# EAGLE schematic JN_Magic Mitts Schematic Proto A v6 (EAGLE 9.7.0)
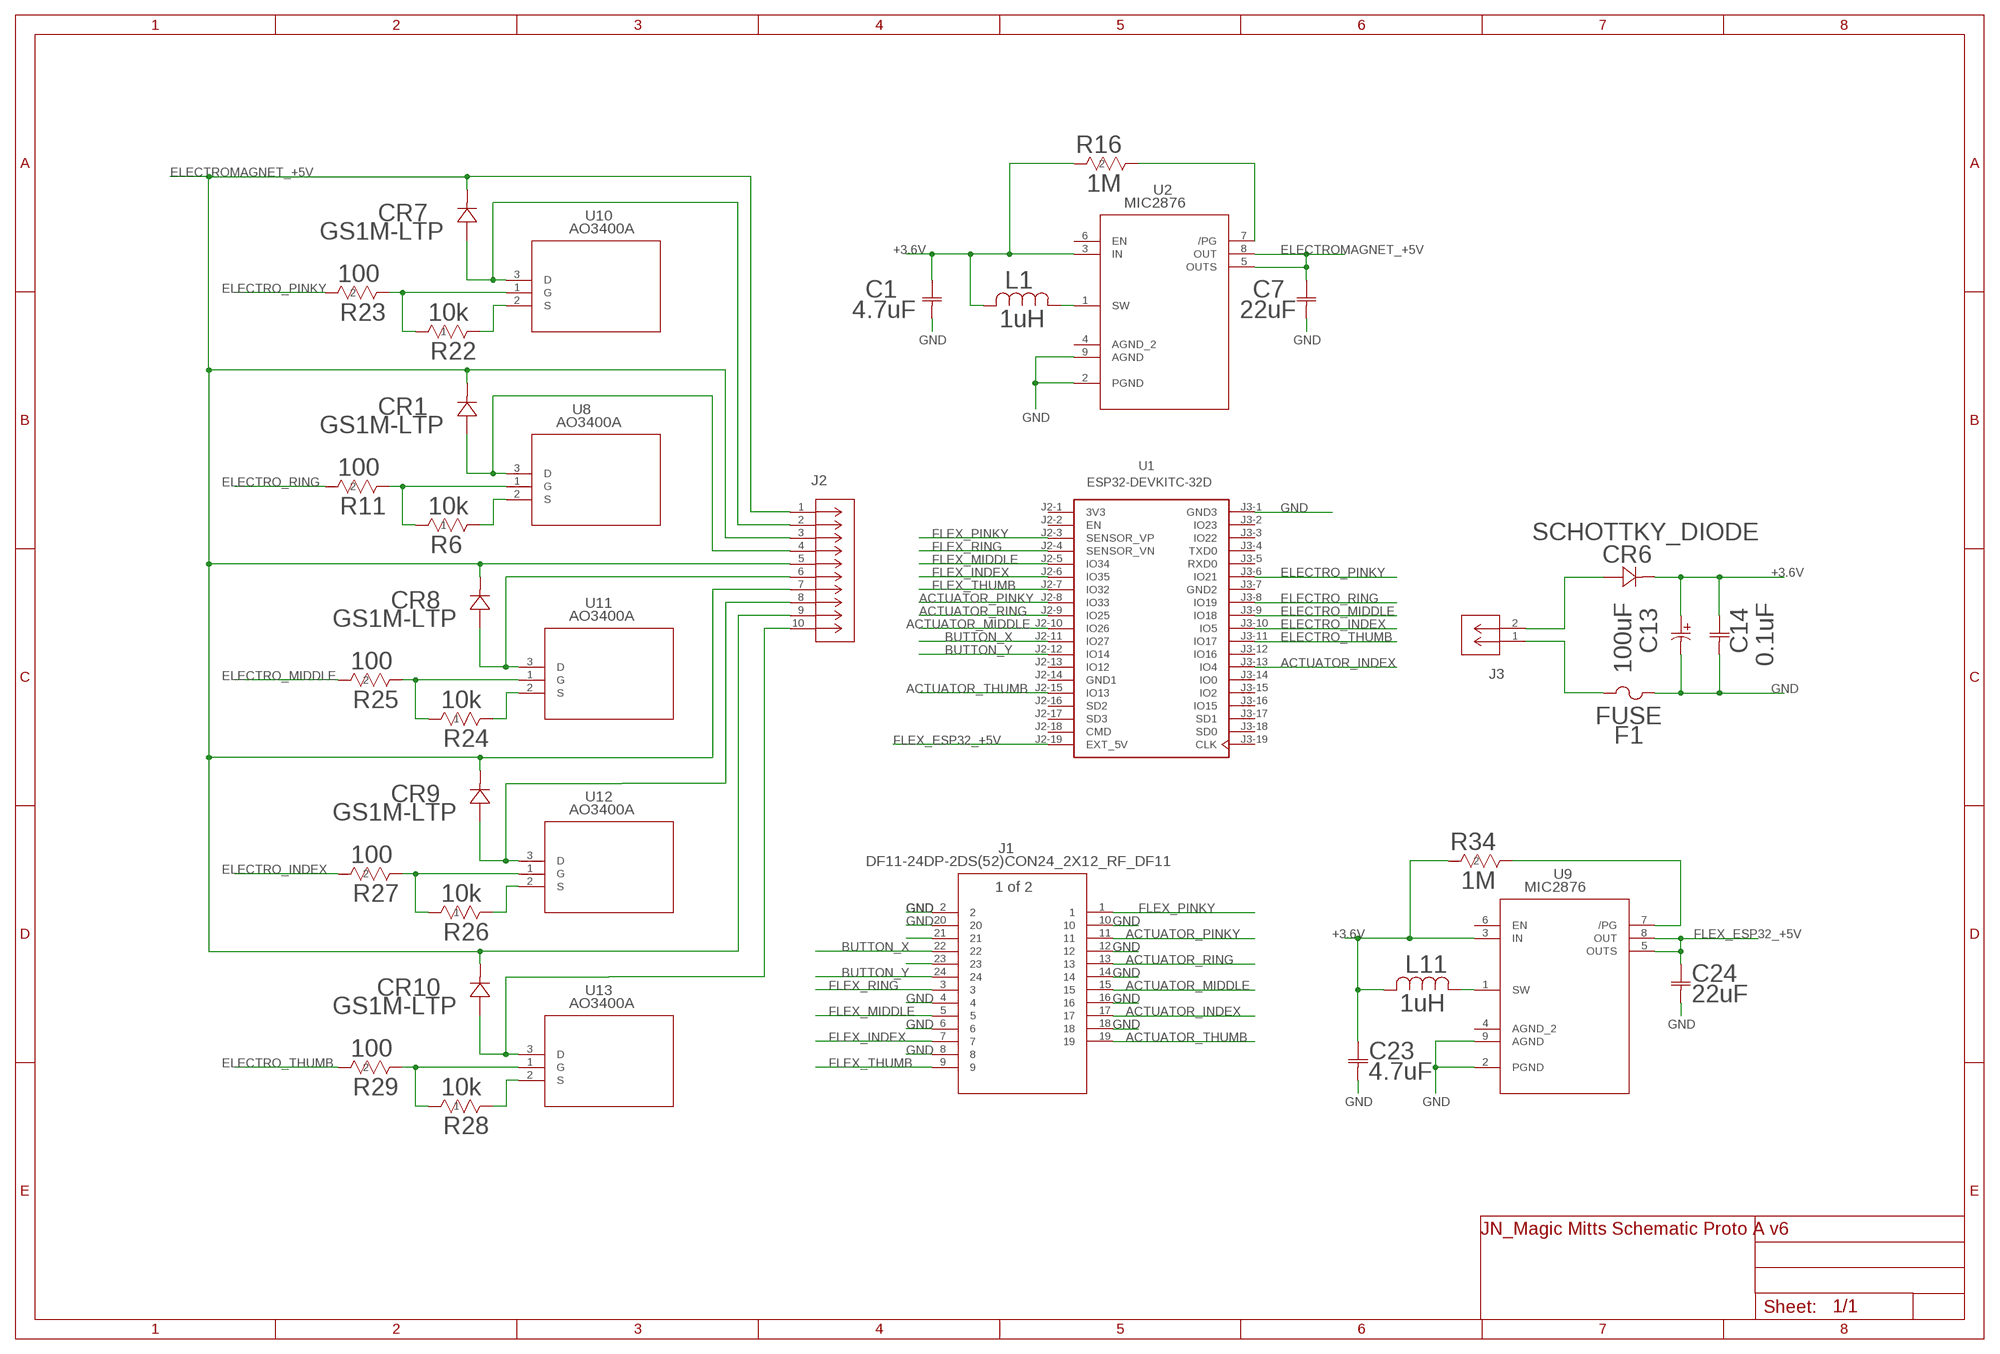
[diagram p0: schematic, sheet 1]

## Parts
C1  4.7uF  CL10A475KP8NNNCAP_CL10_SAM-L  [CAP_CL10_SAM-L]
C7  22uF  CL31A226KPHNNNECAP_CL31_SAM-L  [CAP_CL31_SAM-L]
C13  100uF  UWT1V101MCL1GSPCAP_6.3X7.7-ELECT_NCA-L  [PCAP_6.3X7.7-ELECT_NCA-L]
C14  0.1uF  CL05B104KP5NNNCCAP_CL05_SAM-L  [CAP_CL05_SAM-L]
C23  4.7uF  CL10A475KP8NNNCAP_CL10_SAM-L  [CAP_CL10_SAM-L]
C24  22uF  CL31A226KPHNNNECAP_CL31_SAM-L  [CAP_CL31_SAM-L]
CR1  GS1M-LTP  GS1M-LTPCR_GS1M-LTP_MCE-L  [CR_GS1M-LTP_MCE-L]
CR6  SCHOTTKY_DIODE  MBR1060TO-220_2-LEAD_221B-04_ONS  [TO-220_2-LEAD_221B-04_ONS]
CR7  GS1M-LTP  GS1M-LTPCR_GS1M-LTP_MCE-L  [CR_GS1M-LTP_MCE-L]
CR8  GS1M-LTP  GS1M-LTPCR_GS1M-LTP_MCE-L  [CR_GS1M-LTP_MCE-L]
CR9  GS1M-LTP  GS1M-LTPCR_GS1M-LTP_MCE-L  [CR_GS1M-LTP_MCE-L]
CR10  GS1M-LTP  GS1M-LTPCR_GS1M-LTP_MCE-L  [CR_GS1M-LTP_MCE-L]
F1  FUSE  RUEF400KFUSE_RUEF400K_LTF  [FUSE_RUEF400K_LTF]
J1  DF11-24DP-2DS(52)CON24_2X12_RF_DF11  [CON24_2X12_RF_DF11]
J2  M22-2540505CONN10_M22-254_TYC  [CONN10_M22-254_TYC]
J3  61300211121CONN_61300211121_WRE  [CONN_61300211121_WRE]
L1  1uH  SRP4020TA-1R0MIND_SRP4020TA-1R0M_BRN-L  [IND_SRP4020TA-1R0M_BRN-L]
L11  1uH  SRP4020TA-1R0MIND_SRP4020TA-1R0M_BRN-L  [IND_SRP4020TA-1R0M_BRN-L]
R6  10k  RMCF1206FT10K0STA_RMCF1206_STP-L  [STA_RMCF1206_STP-L]
R11  100  ERJ-8ENF1000VRC1206N_PAN-L  [RC1206N_PAN-L]
R16  1M  RT1206BRD071MLRC1206N_YAG-L  [RC1206N_YAG-L]
R22  10k  RMCF1206FT10K0STA_RMCF1206_STP-L  [STA_RMCF1206_STP-L]
R23  100  ERJ-8ENF1000VRC1206N_PAN-L  [RC1206N_PAN-L]
R24  10k  RMCF1206FT10K0STA_RMCF1206_STP-L  [STA_RMCF1206_STP-L]
R25  100  ERJ-8ENF1000VRC1206N_PAN-L  [RC1206N_PAN-L]
R26  10k  RMCF1206FT10K0STA_RMCF1206_STP-L  [STA_RMCF1206_STP-L]
R27  100  ERJ-8ENF1000VRC1206N_PAN-L  [RC1206N_PAN-L]
R28  10k  RMCF1206FT10K0STA_RMCF1206_STP-L  [STA_RMCF1206_STP-L]
R29  100  ERJ-8ENF1000VRC1206N_PAN-L  [RC1206N_PAN-L]
R34  1M  RT1206BRD071MLRC1206N_YAG-L  [RC1206N_YAG-L]
U1  ESP32-DEVKITC-32D  [MODULE_ESP32-DEVKITC-32D]
U2  MIC2876  MIC2876-5.0YMT-TRUDFN8_2X2_MCH-L  [UDFN8_2X2_MCH-L]
U8  AO3400A  AO3400ASOT-23-3L_AOS-L  [SOT-23-3L_AOS-L]
U9  MIC2876  MIC2876-5.0YMT-TRUDFN8_2X2_MCH-L  [UDFN8_2X2_MCH-L]
U10  AO3400A  AO3400ASOT-23-3L_AOS-L  [SOT-23-3L_AOS-L]
U11  AO3400A  AO3400ASOT-23-3L_AOS-L  [SOT-23-3L_AOS-L]
U12  AO3400A  AO3400ASOT-23-3L_AOS-L  [SOT-23-3L_AOS-L]
U13  AO3400A  AO3400ASOT-23-3L_AOS-L  [SOT-23-3L_AOS-L]

## Nets
+3.6V: C1.1 C13.1 C14.1 C23.1 CR6.1 L1.2 L11.2 R16.2 R34.2 U2.3(IN) U9.3(IN)
ACTUATOR_INDEX: J1.17 U1.J3-13(IO4)
ACTUATOR_MIDDLE: J1.15 U1.J2-10(IO26)
ACTUATOR_PINKY: J1.11 U1.J2-8(IO33)
ACTUATOR_RING: J1.13 U1.J2-9(IO25)
ACTUATOR_THUMB: J1.19 U1.J2-15(IO13)
BUTTON_X: J1.22 U1.J2-11(IO27)
BUTTON_Y: J1.24 U1.J2-12(IO14)
ELECTRO_INDEX: R27.2 U1.J3-10(IO5)
ELECTRO_MIDDLE: R25.2 U1.J3-9(IO18)
ELECTRO_PINKY: R23.2 U1.J3-6(IO21)
ELECTRO_RING: R11.2 U1.J3-8(IO19)
ELECTRO_THUMB: R29.2 U1.J3-11(IO17)
ELECTROMAGNET_+5V: C7.1 CR1.1 CR7.1 CR8.1 CR9.1 CR10.1 J2.1 J2.3 J2.5 J2.7 J2.9 U2.5(OUTS) U2.8(OUT)
FLEX_ESP32_+5V: C24.1 U1.J2-19(EXT_5V) U9.5(OUTS) U9.8(OUT)
FLEX_INDEX: J1.7 U1.J2-6(IO35)
FLEX_MIDDLE: J1.5 U1.J2-5(IO34)
FLEX_PINKY: J1.1 U1.J2-3(SENSOR_VP)
FLEX_RING: J1.3 U1.J2-4(SENSOR_VN)
FLEX_THUMB: J1.9 U1.J2-7(IO32)
GND: C1.2 C7.2 C13.2 C14.2 C23.2 C24.2 F1.1 F1.2 J1.2 J1.4 J1.6 J1.8 J1.10 J1.12 J1.14 J1.16 J1.18 J1.20 J3.1 U1.J3-1(GND3) U2.2(PGND) U2.9(AGND) U9.2(PGND) U9.9(AGND)
N$1: CR6.2 J3.2
N$2: CR7.2 J2.2 U10.3(D)
N$3: L1.1 U2.1(SW)
N$4: R16.1 U2.7(/PG)
N$7: R22.1 R23.1 U10.1(G)
N$8: J1.21
N$9: R22.2 U10.2(S)
N$10: J1.23
N$11: CR1.2 J2.4 U8.3(D)
N$13: R6.1 R11.1 U8.1(G)
N$14: R6.2 U8.2(S)
N$16: CR8.2 J2.6 U11.3(D)
N$18: R24.1 R25.1 U11.1(G)
N$19: R24.2 U11.2(S)
N$21: CR9.2 J2.8 U12.3(D)
N$23: R26.1 R27.1 U12.1(G)
N$24: R26.2 U12.2(S)
N$26: CR10.2 J2.10 U13.3(D)
N$28: R28.1 R29.1 U13.1(G)
N$29: R28.2 U13.2(S)
N$32: L11.1 U9.1(SW)
N$33: R34.1 U9.7(/PG)
Unconnected: U1.J2-2(EN) U1.J2-13(IO12) U1.J2-16(SD2) U1.J2-17(SD3) U1.J2-18(CMD) U1.J3-2(IO23) U1.J3-3(IO22) U1.J3-4(TXD0) U1.J3-5(RXD0) U1.J3-12(IO16) U1.J3-14(IO0) U1.J3-15(IO2) U1.J3-16(IO15) U1.J3-17(SD1) U1.J3-18(SD0) U1.J3-19(CLK) U2.4(AGND_2) U2.6(EN) U9.4(AGND_2) U9.6(EN)

## Power pins joined to a net without a drawn wire
3V3: U1.J2-1(3V3)
GND1: U1.J2-14(GND1)
GND2: U1.J3-7(GND2)

## Library data of the parts
C1 C23 = CL10A475KP8NNN_Library:CL10A475KP8NNN; COPYRIGHT: Copyright (C) 2024 Ultra Librarian. All rights reserved.; MANUFACTURER_PART_NUMBER: CL10A475KP8NNN; MFR_NAME: Samsung
C7 C24 = CL31A226KPHNNNE_Library:CL31A226KPHNNNE; COPYRIGHT: Copyright (C) 2024 Ultra Librarian. All rights reserved.; MANUFACTURER_PART_NUMBER: CL31A226KPHNNNE; MFR_NAME: Samsung
C13 = UWT1V101MCL1GS_Library:UWT1V101MCL1GS; COPYRIGHT: Copyright (C) 2024 Ultra Librarian. All rights reserved.; MANUFACTURER_PART_NUMBER: UWT1V101MCL1GS; MFR_NAME: Nichicon
C14 = CL05B104KP5NNNC_Library:CL05B104KP5NNNC; COPYRIGHT: Copyright (C) 2024 Ultra Librarian. All rights reserved.; MANUFACTURER_PART_NUMBER: CL05B104KP5NNNC; MFR_NAME: Samsung
CR1 CR7-CR10 = GS1M-LTP_Library:GS1M-LTP; COPYRIGHT: Copyright (C) 2024 Ultra Librarian. All rights reserved.; MANUFACTURER_PART_NUMBER: GS1M-LTP; MFR_NAME: MCC
CR6 = MBR1060_Library:MBR1060; COPYRIGHT: Copyright (C) 2024 Ultra Librarian. All rights reserved.; MANUFACTURER_PART_NUMBER: MBR1060; MFR_NAME: onsemi
F1 = RUEF400K_Library:RUEF400K; COPYRIGHT: Copyright (C) 2024 Ultra Librarian. All rights reserved.; MANUFACTURER_PART_NUMBER: RUEF400K; MFR_NAME: Littelfuse Inc
J1 = DF11-24DP-2DS-52_Library:DF11-24DP-2DS(52); COPYRIGHT: Copyright (C) 2024 Ultra Librarian. All rights reserved.; MANUFACTURER_PART_NUMBER: DF11-24DP-2DS(52); MFR_NAME: Hirose
J2 = M22-2540505_Library:M22-2540505; COPYRIGHT: Copyright (C) 2024 Ultra Librarian. All rights reserved.; MANUFACTURER_PART_NUMBER: M22-2540505; MFR_NAME: Harwin
J3 = 61300211121_Library:61300211121; COPYRIGHT: Copyright (C) 2024 Ultra Librarian. All rights reserved.; MANUFACTURER_PART_NUMBER: 61300211121; MFR_NAME: Wurth Electronics
L1 L11 = SRP4020TA-1R0M_Library:SRP4020TA-1R0M; COPYRIGHT: Copyright (C) 2024 Ultra Librarian. All rights reserved.; MANUFACTURER_PART_NUMBER: SRP4020TA-1R0M; MFR_NAME: Bourns Electronics; TYPE: Fixed Inductors
R6 R22 R24 R26 R28 = RMCF1206FT10K0_Library:RMCF1206FT10K0; COPYRIGHT: Copyright (C) 2024 Ultra Librarian. All rights reserved.; MANUFACTURER_PART_NUMBER: RMCF1206FT10K0; MFR_NAME: Stackpole International
R11 R23 R25 R27 R29 = ERJ-8ENF1000V_Library:ERJ-8ENF1000V; COPYRIGHT: Copyright (C) 2024 Ultra Librarian. All rights reserved.; MANUFACTURER_PART_NUMBER: ERJ-8ENF1000V; MFR_NAME: Panasonic
R16 R34 = RT1206BRD071ML_Library:RT1206BRD071ML; COPYRIGHT: Copyright (C) 2024 Ultra Librarian. All rights reserved.; MANUFACTURER_PART_NUMBER: RT1206BRD071ML; MFR_NAME: Yageo
U1 = ESP32-DEVKITC-32D_Library:ESP32-DEVKITC-32D: Check availability <https://pricing.snapeda.com/parts/ESP32-DEVKITC-32D/Espressif%20Systems/view-part?ref=eda>; AVAILABILITY: In Stock; CHECK_PRICES: https://www.snapeda.com/parts/ESP32-DEVKITC-32D/Espressif+Systems/view-part/?ref=eda; DESCRIPTION: WiFi Development Tools (802.11) ESP32 General Development Kit, ESP32-WROOM-32D on the board; MF: Espressif Systems; MP: ESP32-DEVKITC-32D; PACKAGE: None; PRICE: None; SNAPEDA_LINK: https://www.snapeda.com/parts/ESP32-DEVKITC-32D/Espressif+Systems/view-part/?ref=snap
U2 U9 = MIC2876-5-0YMT-TR_Library:MIC2876-5.0YMT-TR; COPYRIGHT: Copyright (C) 2024 Ultra Librarian. All rights reserved.; MANUFACTURER_PART_NUMBER: MIC2876-5.0YMT-TR; MFR_NAME: Microchip; TYPE: Power Management
U8 U10-U13 = AO3400A:AO3400A; COPYRIGHT: Copyright (C) 2024 Ultra Librarian. All rights reserved.; MANUFACTURER_PART_NUMBER: AO3400A; MFR_NAME: Alpha and Omega Semiconductor